# EAGLE schematic Blank Shield (from Due) v5 (EAGLE 9.7.0)
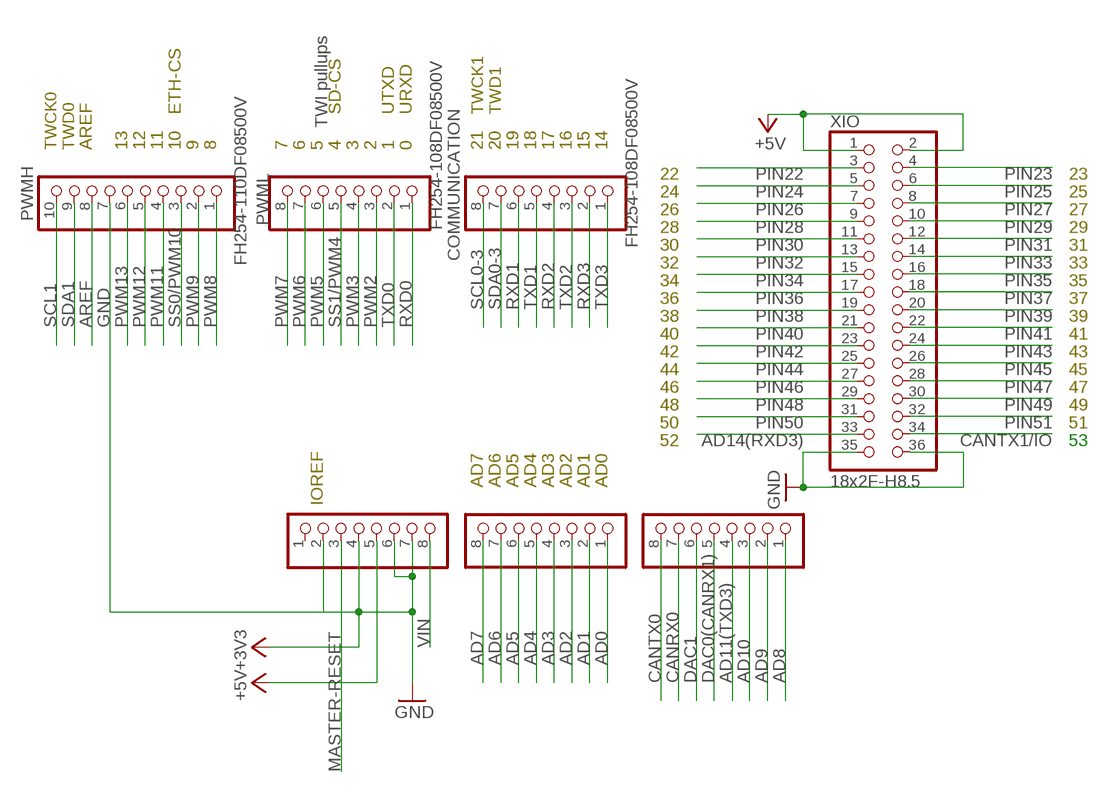
[diagram p0: schematic, sheet 1]

## Parts
ADCH  FH254-108DF08500V  1683_20TW-536  [1X08]
ADCL  FH254-108DF08500V  1683_20TW-536  [1X08]
COMMUNICATION  FH254-108DF08500V  1683_20TW-536  [1X08]
POWER  FH254-108DF08500V  1683_20TW-536  [1X08]
PWMH  FH254-110DF08500V  1684_20TW-537  [1X10]
PWML  FH254-108DF08500V  1683_20TW-536  [1X08]
XIO  18x2F-H8.5  1756_12TW323  [2X18]

## Nets
+3V3: POWER.2 POWER.4
+5V: POWER.5 XIO.1 XIO.2
AD0: ADCL.1
AD1: ADCL.2
AD2: ADCL.3
AD3: ADCL.4
AD4: ADCL.5
AD5: ADCL.6
AD6: ADCL.7
AD7: ADCL.8
AD8: ADCH.1
AD9: ADCH.2
AD10: ADCH.3
AD11(TXD3): ADCH.4
AD14(RXD3): XIO.33
AREF: PWMH.8
CANRX0: ADCH.7
CANTX0: ADCH.8
CANTX1/IO: XIO.34
DAC0(CANRX1): ADCH.5
DAC1: ADCH.6
GND: POWER.6 POWER.7 PWMH.7 XIO.35 XIO.36
MASTER-RESET: POWER.3
PIN22: XIO.3
PIN23: XIO.4
PIN24: XIO.5
PIN25: XIO.6
PIN26: XIO.7
PIN27: XIO.8
PIN28: XIO.9
PIN29: XIO.10
PIN30: XIO.11
PIN31: XIO.12
PIN32: XIO.13
PIN33: XIO.14
PIN34: XIO.15
PIN35: XIO.16
PIN36: XIO.17
PIN37: XIO.18
PIN38: XIO.19
PIN39: XIO.20
PIN40: XIO.21
PIN41: XIO.22
PIN42: XIO.23
PIN43: XIO.24
PIN44: XIO.25
PIN45: XIO.26
PIN46: XIO.27
PIN47: XIO.28
PIN48: XIO.29
PIN49: XIO.30
PIN50: XIO.31
PIN51: XIO.32
PWM2: PWML.3
PWM3: PWML.4
PWM5: PWML.6
PWM6: PWML.7
PWM7: PWML.8
PWM8: PWMH.1
PWM9: PWMH.2
PWM11: PWMH.4
PWM12: PWMH.5
PWM13: PWMH.6
RXD0: PWML.1
RXD1: COMMUNICATION.6
RXD2: COMMUNICATION.4
RXD3: COMMUNICATION.2
SCL0-3: COMMUNICATION.8
SCL1: PWMH.10
SDA0-3: COMMUNICATION.7
SDA1: PWMH.9
SS0/PWM10: PWMH.3
SS1/PWM4: PWML.5
TXD0: PWML.2
TXD1: COMMUNICATION.5
TXD2: COMMUNICATION.3
TXD3: COMMUNICATION.1
VIN: POWER.8
Unconnected: POWER.1

## Notes on the sheet
- ETH-CS | SD-CS | UTXD | URXD | TWCK1 | TWD1
- TWI pullups
- TWCK0 | TWD0 | AREF | 13 | 12 | 11 | 10 | 9 | 8 | 7 | 6 | 5 | 4 | 3 | 2 | 1 | 0 | 21 | 20 | 19 | 18 | 17 | 16 | 15 | 14
- 22 | 23
- 24 | 25
- 26 | 27
- 28 | 29
- 30 | 31
- 32 | 33
- 34 | 35
- 36 | 37
- 38 | 39
- 40 | 41
- 42 | 43
- 44 | 45
- 46 | 47
- 48 | 49
- 50 | 51
- 52 | 53
- AD7 | AD6 | AD5 | AD4 | AD3 | AD2 | AD1 | AD0
- IOREF

## Library data of the parts
ADCH ADCL COMMUNICATION POWER PWML = Connettori:1683_20TW-536: Female Gray Connector strip for Arduino 3V3 bases - 8x1 F V h 8,5 p2,54mm; MONTHLY_USAGE: _____; PART_NUMBER: 20TW-536; PRICE: _____; SUPPLIER: _____; TYPE: Connettori
PWMH = Connettori:1684_20TW-537: Female Gray Connector strip for Arduino 3V3 bases - 10x1 F V h 8,5 p2,54mm; MONTHLY_USAGE: _____; PART_NUMBER: 20TW-537; PRICE: _____; SUPPLIER: _____; TYPE: Connettori
XIO = Connettori:1756_12TW323: Female Gray Connector strip for Arduino 3V3 bases 18x2 F V h 8,5 p2,54; MONTHLY_USAGE: _____; PART_NUMBER: 12TW323; PRICE: _____; SUPPLIER: _____; TYPE: Connettori

## Net classes
0 default: width 0.203 mm, drill 0.406 mm, clearance 0.203 mm
1 USB: width 0.203 mm, drill 0.406 mm, clearance 0.203 mm
2 gnd: width 0.203 mm, drill 0.406 mm, clearance 0.203 mm
3 usbvcc: width 0.203 mm, drill 0.406 mm, clearance 0.203 mm
4 USBpair: width 0.254 mm, drill 0.406 mm, clearance 0.61 mm to class 0, clearance 0.61 mm to class 1, clearance 0.61 mm to class 2, clearance 0.61 mm to class 3